# Altium project Filter-SK.PrjPcb
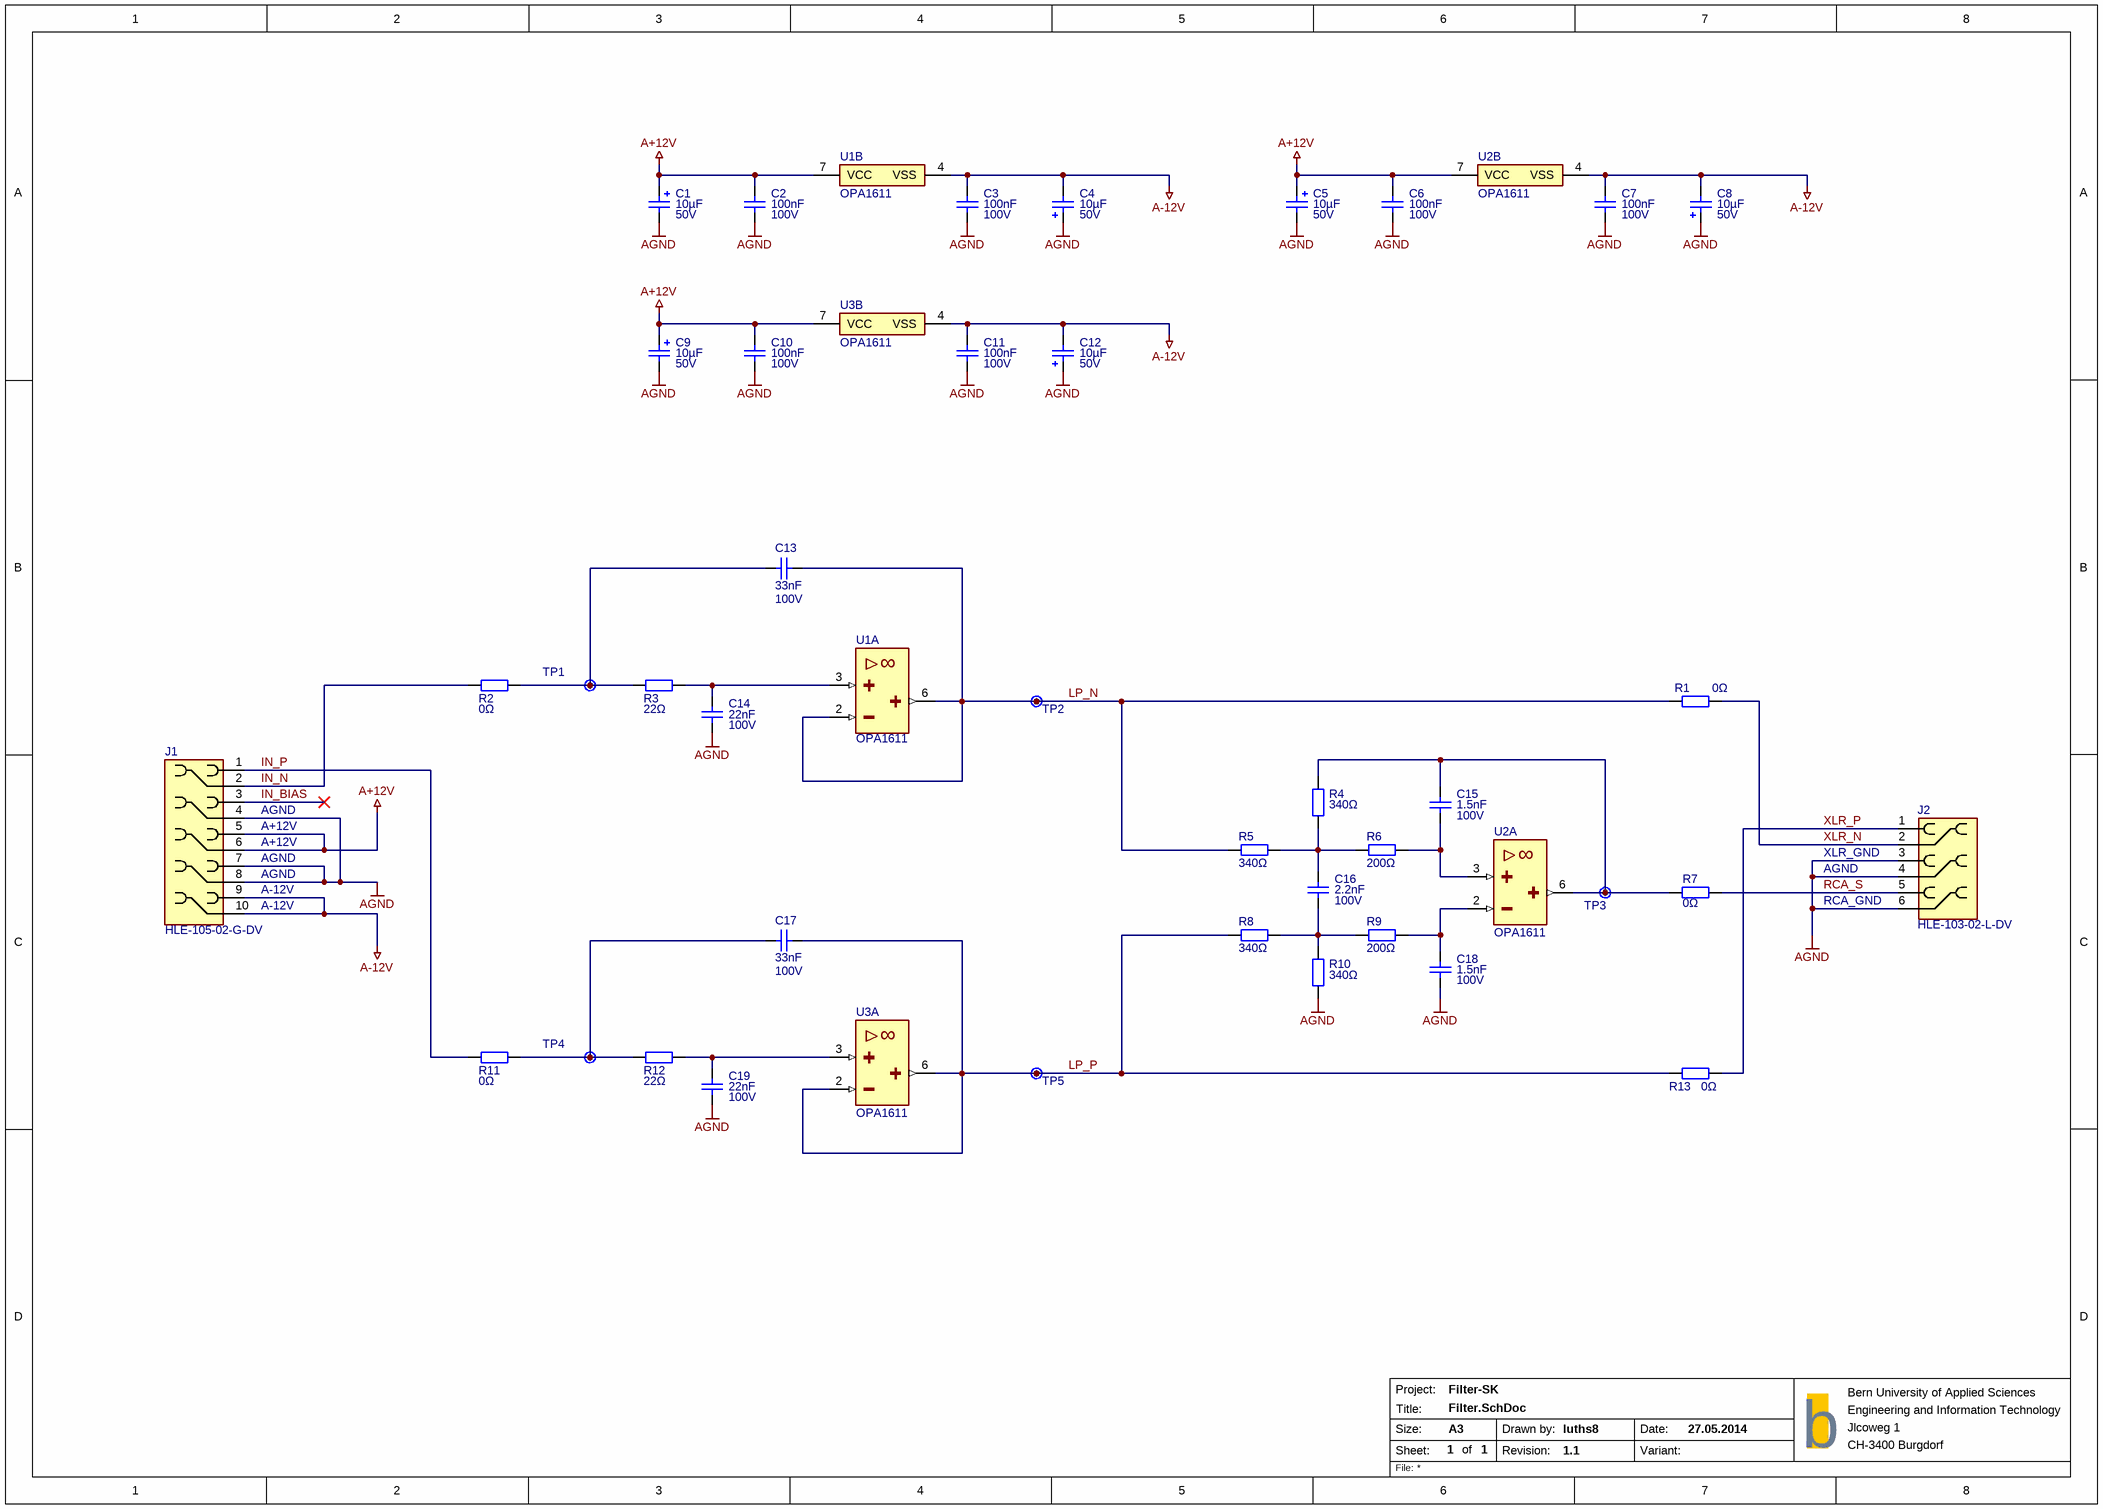
[diagram p0: Filter.SchDoc]
ProjectAuthors: Klossner, Lüthi; ProjectName: Filter-SK; Revision: 1.1
1 sheet, 42 parts. Net scope: hierarchical (ports join the sheet entries above them; power ports are global).
Board file: Filter-SK.PcbDoc

## Sheet Filter.SchDoc
size A3; Date: 27.05.2014; DrawnBy: luths8; Organization: BFH; Address1: Bern University of Applied Sciences; Address2: Engineering and Information Technology; Address3: Jlcoweg 1; Address4: CH-3400 Burgdorf; DocumentNumber: 1; Revision: 1.1; SheetNumber: 1; SheetTotal: 1; CurrentDate: 27.05.2014

### Parts
C1  10µF  Voltage: 50V  [CAP-5-11.5-2]
C2  100nF  Voltage: 100V  [CAP_WIMA_MKP4F]
C3  100nF  Voltage: 100V  [CAP_WIMA_MKP4F]
C4  10µF  Voltage: 50V  [CAP-5-11.5-2]
C5  10µF  Voltage: 50V  [CAP-5-11.5-2]
C6  100nF  Voltage: 100V  [CAP_WIMA_MKP4F]
C7  100nF  Voltage: 100V  [CAP_WIMA_MKP4F]
C8  10µF  Voltage: 50V  [CAP-5-11.5-2]
C9  10µF  Voltage: 50V  [CAP-5-11.5-2]
C10  100nF  Voltage: 100V  [CAP_WIMA_MKP4F]
C11  100nF  Voltage: 100V  [CAP_WIMA_MKP4F]
C12  10µF  Voltage: 50V  [CAP-5-11.5-2]
C13  33nF  Voltage: 100V  [CAP_WIMA_FKP2C]
C14  22nF  Voltage: 100V  [CAP_WIMA_FKP2C]
C15  1.5nF  Voltage: 100V  [CAP_WIMA_FKP2D]
C16  2.2nF  Voltage: 100V  [CAP_WIMA_FKP2D]
C17  33nF  Voltage: 100V  [CAP_WIMA_FKP2C]
C18  1.5nF  Voltage: 100V  [CAP_WIMA_FKP2D]
C19  22nF  Voltage: 100V  [CAP_WIMA_FKP2C]
J1  HLE-105-02-G-DV  [HLE-105-02-XXX-DV-A]
J2  HLE-103-02-L-DV  [HLE-103-02-XXX-DV]
R1  0Ω  [SMD0603RES]
R2  0Ω  [SMD0603RES]
R3  22Ω  [SMD0603RES]
R4  340Ω  [SMD0603RES]
R5  340Ω  [SMD0603RES]
R6  200Ω  [SMD0603RES]
R7  0Ω  [SMD0603RES]
R8  340Ω  [SMD0603RES]
R9  200Ω  [SMD0603RES]
R10  340Ω  [SMD0603RES]
R11  0Ω  [SMD0603RES]
R12  22Ω  [SMD0603RES]
R13  0Ω  [SMD0603RES]
TP1  Testpoint  [TP]  (value not drawn)  (no BOM)
TP2  Testpoint  [TP]  (value not drawn)  (no BOM)
TP3  Testpoint  [TP]  (value not drawn)  (no BOM)
TP4  Testpoint  [TP]  (value not drawn)  (no BOM)
TP5  Testpoint  [TP]  (value not drawn)  (no BOM)
U1  OPA1611  [DIP8-SOIC8]  (parts A,B of 2)
U2  OPA1611  [DIP8-SOIC8]  (parts A,B of 2)
U3  OPA1611  [DIP8-SOIC8]  (parts A,B of 2)

### Nets
A+12V: C1.P C2.2(q) C5.P C6.2(q) C9.P C10.2(q) J1.5 J1.6 U1.7(VCC) U2.7(VCC) U3.7(VCC)
A-12V: C3.1 C4.M(q) C7.1 C8.M(q) C11.1 C12.M(q) J1.9 J1.10 U1.4(VSS) U2.4(VSS) U3.4(VSS)
AGND: C1.M(q) C2.1 C3.2(q) C4.P C5.M(q) C6.1 C7.2(q) C8.P C9.M(q) C10.1 C11.2(q) C12.P C14.2(q) C18.1 C19.2(q) J1.4 J1.7 J1.8 J2.3 J2.4 J2.6 R10.1
IN_BIAS: J1.3
IN_N: J1.2 R2.2
IN_P: J1.1 R11.2
LP_N: C13.2(q) R1.2 R5.2 TP2.1 U1.2(NIN) U1.6(OUT)
LP_P: C17.2(q) R8.2 R13.2 TP5.1 U3.2(NIN) U3.6(OUT)
RCA_S: J2.5 R7.1
XLR_N: J2.2 R1.1
XLR_P: J2.1 R13.1
NetC13_1: C13.1 R2.1 R3.2 TP1.1
NetC14_1: C14.1 R3.1 U1.3(PIN)
NetC15_1: C15.1 R4.1 R7.2 TP3.1 U2.6(OUT)
NetC15_2: C15.2(q) R6.2 U2.3(PIN)
NetC16_1: C16.1 R4.2 R5.1 R6.1
NetC16_2: C16.2(q) R8.1 R9.1 R10.2
NetC17_1: C17.1 R11.1 R12.2 TP4.1
NetC18_2: C18.2(q) R9.2 U2.2(NIN)
NetC19_1: C19.1 R12.1 U3.3(PIN)

### Notes on the sheet
- (near J1) A+12V
- (near J1) AGND
- (near J2) XLR_GND
- (near J1) A-12V
- (near J2) RCA_GND
- AGND
- Project:
- Size:
- Sheet:
- Title:
- A3
- of
- Drawn by:
- Revision:
- Date:
- Variant:
- b
- File:
- (in symbol OPA1611, part A) ∞

### Library data of the parts
C1 C4 C5 C8 C9 C12 = Capacitor Electrolytic: Elektrolytic Capacitor; Manufacturer Part No.: EEU-FR1H100
C2 C3 C6 C7 C10 C11 = Capacitor Ceramic: Ceramic Capacitor; Manufacturer Part No.: MKP2D031001F00KF00
C13 C17 = Capacitor Ceramic: Ceramic Capacitor; Manufacturer Part No.: FKP2C023301L00HFSSD
C14 C19 = Capacitor Ceramic: Ceramic Capacitor; Manufacturer Part No.: FKP2D022201L00HF00
C15 C18 = Capacitor Ceramic: Ceramic Capacitor; Manufacturer Part No.: FKP2D011501D00HSSD
C16 = Capacitor Ceramic: Ceramic Capacitor; Manufacturer Part No.: FKP2D012201D00HSSD
J1 = Receptacle 5x2P: Manufacturer Part No.: HLE-105-02-G-DV
J2 = Receptacle 3x2P: Manufacturer Part No.: HLE-103-02-L-DV
R1 R7 R13 = Resistor: Resistor Thin Film; Manufacturer Part No.: TNPW060347R0BEEA
R2 R3 R11 R12 = Resistor: Resistor Thin Film; Manufacturer Part No.: TNPW060322R0BEEA
R4 R5 R8 R10 = Resistor: Resistor Thin Film; Manufacturer Part No.: TNPW0603340RBEEA
R6 R9 = Resistor: Resistor Thin Film; Manufacturer Part No.: TNPW0603200RBEEA
U1-U3 = OPA1611: SoundPlus Operational Amplifier; Manufacturer Part No.: OPA1611
TP1-TP5 = Testpoint: Manufacturer Part No.: *